# Altium schematic sheet gpio.SchDoc
size A4; SheetNumber: 10; SheetTotal: 21
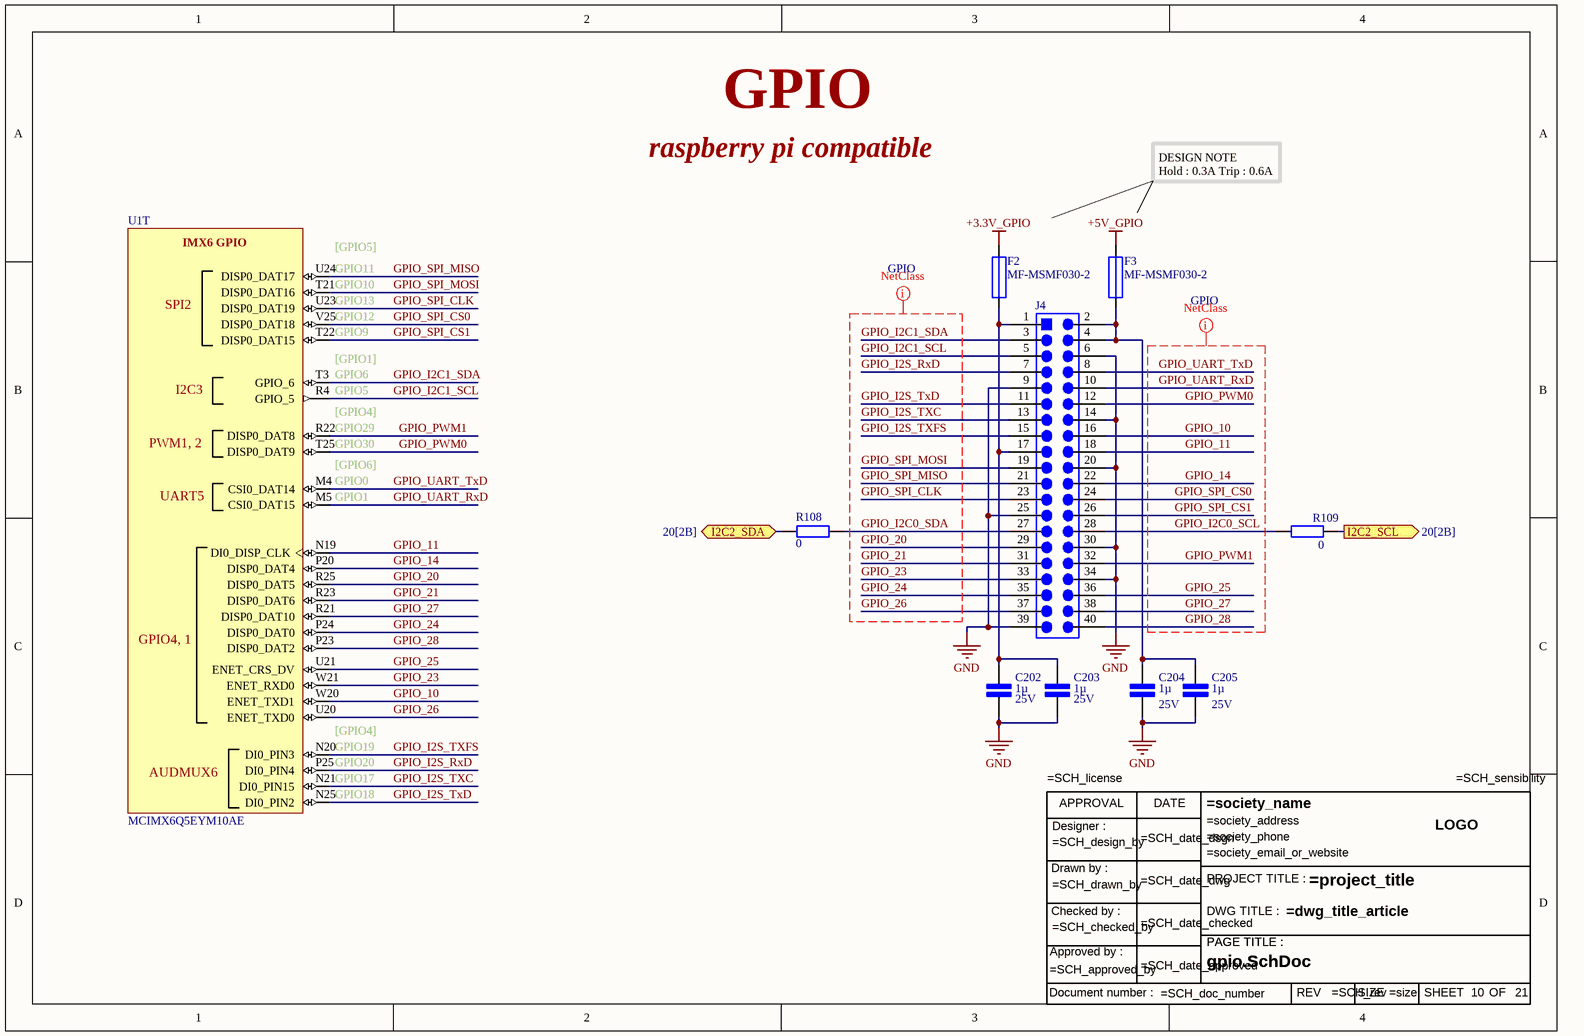
[diagram p0: gpio.SchDoc]

## Parts
C202  1µ  Tension du diélectrique: 25V  [Cap cer 0402/1005]
C203  1µ  Tension du diélectrique: 25V  [Cap cer 0402/1005]
C204  1µ  Tension du diélectrique: 25V  [Cap cer 0402/1005]
C205  1µ  Tension du diélectrique: 25V  [Cap cer 0402/1005]
F2  MF-MSMF030-2  [Fuse 1812/4532 MF-MSMF050-2]
F3  MF-MSMF030-2  [Fuse 1812/4532 MF-MSMF050-2]
J4  header_rasppi_61304021121  [header_rasppi_61304021121]  (value not drawn)
R108  0  [Res 0603/1603]
R109  0  [Res 0603/1603]
TB9  Title bloc ANSI modified  (value not drawn)
U1  MCIMX6Q5EYM10AE  [FRES-2197-01]  (part T of 21)

## Ports
I2C2_SCL (out, see 20[2B]), I2C2_SDA (bidir, see 20[2B])

## Nets
+3.3V_GPIO: F2.2
+5V_GPIO: F3.2
GND: C202.2 C203.2 C204.2 C205.2 J4.6 J4.9 J4.14 J4.20 J4.25 J4.30 J4.34 J4.39
GPIO_10: J4.16 U1.W20(ENET_TXD1)
GPIO_11: J4.18 U1.N19(DI0_DISP_CLK)
GPIO_14: J4.22 U1.P20(DISP0_DAT4)
GPIO_20: J4.29 U1.R25(DISP0_DAT5)
GPIO_21: J4.31 U1.R23(DISP0_DAT6)
GPIO_23: J4.33 U1.W21(ENET_RXD0)
GPIO_24: J4.35 U1.P24(DISP0_DAT0)
GPIO_25: J4.36 U1.U21(ENET_CRS_DV)
GPIO_26: J4.37 U1.U20(ENET_TXD0)
GPIO_27: J4.38 U1.R21(DISP0_DAT10)
GPIO_28: J4.40 U1.P23(DISP0_DAT2)
GPIO_I2C0_SCL: J4.28 R109.1
GPIO_I2C0_SDA: J4.27 R108.2
GPIO_I2C1_SCL: J4.5 U1.R4(GPIO_5)
GPIO_I2C1_SDA: J4.3 U1.T3(GPIO_6)
GPIO_I2S_RxD: J4.7 U1.P25(DI0_PIN4)
GPIO_I2S_TXC: J4.13 U1.N21(DI0_PIN15)
GPIO_I2S_TxD: J4.11 U1.N25(DI0_PIN2)
GPIO_I2S_TXFS: J4.15 U1.N20(DI0_PIN3)
GPIO_PWM0: J4.12 U1.T25(DISP0_DAT9)
GPIO_PWM1: J4.32 U1.R22(DISP0_DAT8)
GPIO_SPI_CLK: J4.23 U1.U23(DISP0_DAT19)
GPIO_SPI_CS0: J4.24 U1.V25(DISP0_DAT18)
GPIO_SPI_CS1: J4.26 U1.T22(DISP0_DAT15)
GPIO_SPI_MISO: J4.21 U1.U24(DISP0_DAT17)
GPIO_SPI_MOSI: J4.19 U1.T21(DISP0_DAT16)
GPIO_UART_RxD: J4.10 U1.M5(CSI0_DAT15)
GPIO_UART_TxD: J4.8 U1.M4(CSI0_DAT14)
I2C2_SCL: R109.2 ; port I2C2_SCL
I2C2_SDA: R108.1 ; port I2C2_SDA
NetC202_1: C202.1 C203.1 F2.1 J4.1 J4.17
NetC204_1: C204.1 C205.1 F3.1 J4.2 J4.4

## Layout directives
net class GPIO: GPIO_10, GPIO_11, GPIO_14, GPIO_20, GPIO_21, GPIO_23, GPIO_24, GPIO_25, GPIO_26, GPIO_27, GPIO_28, GPIO_I2C0_SCL, GPIO_I2C0_SDA, GPIO_I2C1_SCL, GPIO_I2C1_SDA, GPIO_I2S_RxD, GPIO_I2S_TXC, GPIO_I2S_TxD, GPIO_I2S_TXFS, GPIO_PWM0, GPIO_PWM1, GPIO_SPI_CLK, GPIO_SPI_CS0, GPIO_SPI_CS1, GPIO_SPI_MISO, GPIO_SPI_MOSI, GPIO_UART_RxD, GPIO_UART_TxD

## Notes on the sheet
- raspberry pi compatible
- GPIO
- DESIGN NOTE
  Hold : 0.3A Trip : 0.6A
- (near U1) GPIO11
- (near U1) [GPIO5]
- (near U1) GPIO10
- (near U1) GPIO13
- (near U1) GPIO12
- (near U1) GPIO9
- (near U1) GPIO6
- (near U1) [GPIO1]
- (near U1) GPIO5
- (near U1) GPIO29
- (near U1) GPIO30
- (near U1) [GPIO4]
- (near U1) GPIO0
- (near U1) GPIO1
- (near U1) [GPIO6]
- (near U1) GPIO19
- (near U1) GPIO20
- (near U1) GPIO17
- (near U1) GPIO18
- (in symbol IMX6Q5EYM10AE, part T) IMX6 GPIO; SPI2; I2C3; PWM1, 2; UART5; GPIO4, 1; AUDMUX6
- (in symbol Title bloc ANSI) APPROVAL; DATE; Designer :; LOGO; Drawn by :; PROJECT TITLE :; Checked by :; DWG TITLE :; PAGE TITLE :; Approved by :; Document number :; REV; SIZE; SHEET; OF

## Library data of the parts
C202-C205 = cap 1µ 25V: cap cer 1µ 25V 10% X5R 0402; Diélectrique: X5R
F2 F3 = Fuse PPTC 0.3A: Hold : 0.3A, trip 0.6A 30V 1812
J4 = header_rasppi_61304021121: header raspberry pi compatible
R108 R109 = res 0Ohm: res 0603; pourcentage: --
TB9 = Title bloc ANSI
U1 = IMX6Q5EYM10AE: 32-Bit i.MX 6 Quad Application Processor, 1 GHz, 256 KB RAM, Extended Consumer Grade, 624-Pin FCPBGA, RoHS, Tape and Reel; PartNumber: MCIMX6Q5EYM10ACR; Manufacturer: Freescale Semiconductor; CAN: FlexCAN; Number of Cores: 4 Spec; External Memory Supported: DDR3, DDR3L, FLASH, LPDDR2; Speed Grade: 1 GHz; Core Type: ARM Cortex A9; Cache (KB): 32; Ethernet: 1 Gbps + IEEE 1588; Internal RAM (KB): 256; ComponentLink1Description: Manufacturer URL; ComponentLink2Description: Datasheet; DatasheetVersion: Rev. 2.3; ComponentLink3URL: http://cache.freescale.com/files/32bit/doc/data_sheet/IMX6DQCEC.pdf?fpsp=1&WT_TYPE=Data%20Sheets&WT_VENDOR=FREESCALE&WT_FILE_FORMAT=pdf&WT_ASSET=Documentation; ComponentLink1URL: http://www.freescale.com/; Packing: Tape and Reel; Temperature Range: -20 to 105 degC; ComponentLink2URL: http://cache.freescale.com/files/32bit/doc/data_sheet/IMX6DQCEC.pdf?fpsp=1&WT_TYPE=Data%20Sheets&WT_VENDOR=FREESCALE&WT_FILE_FORMAT=pdf&WT_ASSET=Documentation; ComponentLink3Description: Package Specification; PackageVersion: Rev. A; RoHS: TRUE; Quad/Dual CPU: i.MX 6Quad; Mounting Technology: Surface Mount; PackageReference: FCPBGA-624; PackageDescription: 624-pin Ball Grid Array Package, Body 21 x 21mm, Pitch 0.8mm